# Altium project c1-12.PrjPCB (part 3 of 3)
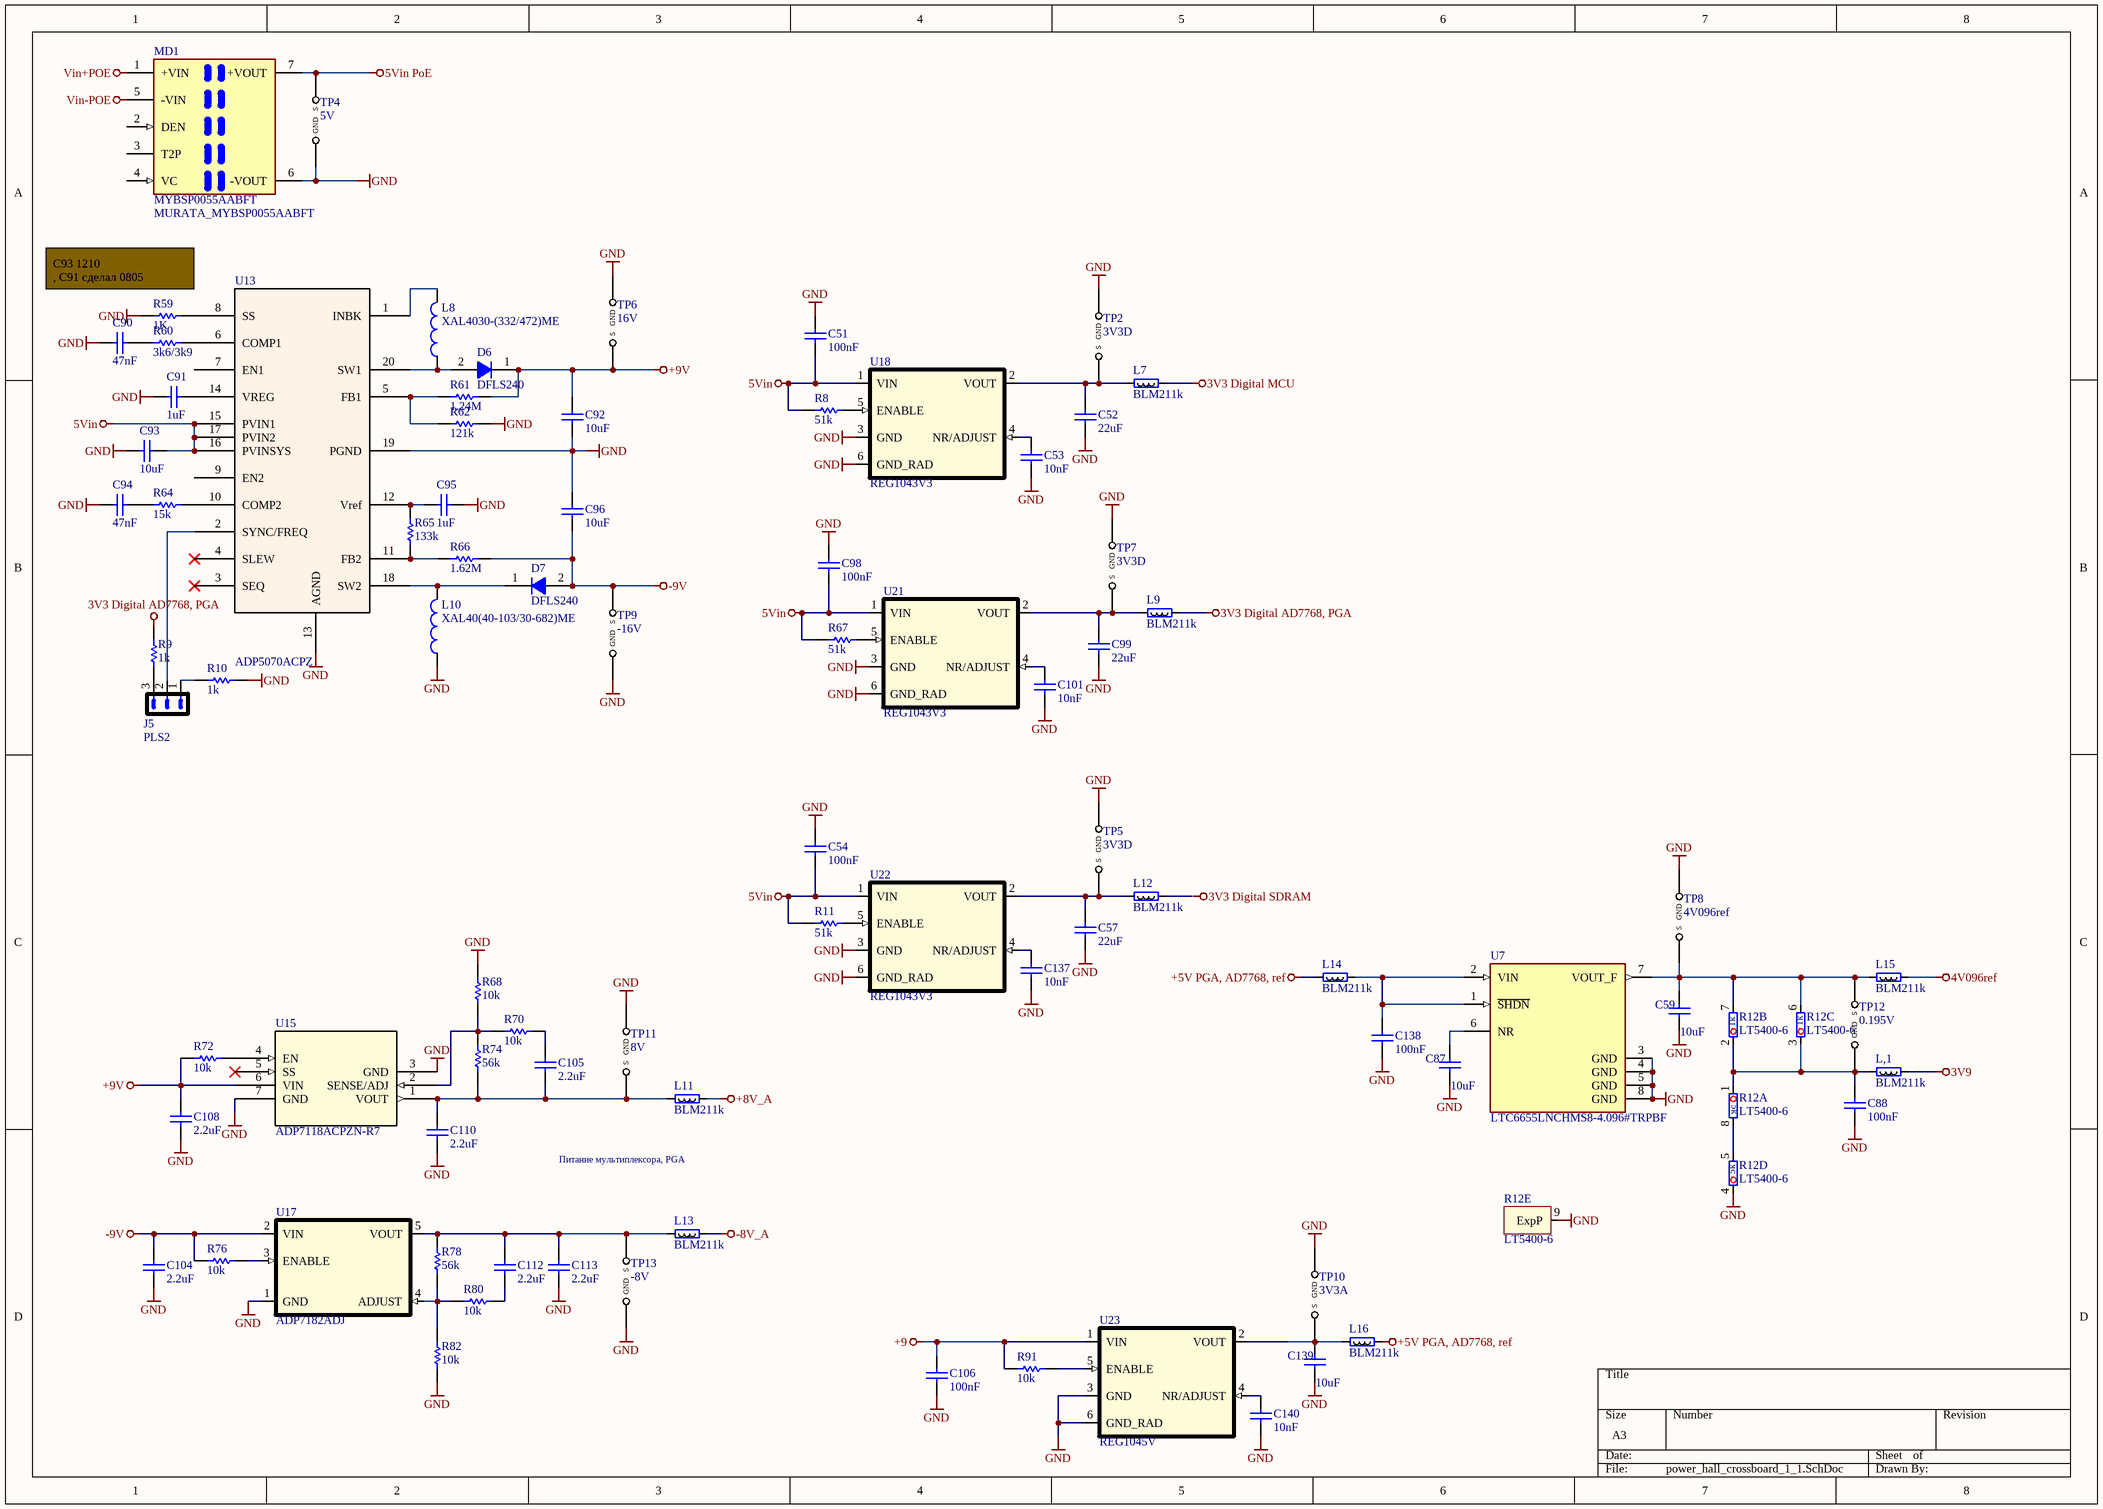
[diagram p10: power_hall_crossboard_1_1.SchDoc]

## Nets that join several sheets
2V5 VOCM AD7768: AD7768_inputs_hall_crossboard_1_1 (U1.59), U_AD7768_inputs_hall_crossboard_1_1/meas_ch1 (meas_ch1_C48.2 meas_ch1_U6.21), U_AD7768_inputs_hall_crossboard_1_1/meas_ch2 (meas_ch2_C48.2 meas_ch2_U6.21), U_AD7768_inputs_hall_crossboard_1_1/meas_ch3 (meas_ch3_C48.2 meas_ch3_U6.21), U_AD7768_inputs_hall_crossboard_1_1/meas_ch4 (meas_ch4_C48.2 meas_ch4_U6.21), U_AD7768_inputs_hall_crossboard_1_1/meas_ch5 (meas_ch5_C48.2 meas_ch5_U6.21), U_AD7768_inputs_hall_crossboard_1_1/meas_ch6 (meas_ch6_C48.2 meas_ch6_U6.21), U_AD7768_inputs_hall_crossboard_1_1/meas_ch7 (meas_ch7_C48.2 meas_ch7_U6.21), U_AD7768_inputs_hall_crossboard_1_1/meas_ch8 (meas_ch8_C48.2 meas_ch8_U6.21)
3V3 Digital AD7768, PGA: MCU_hall_crossboard_1_1 (C103.1 R94.1 R101.2 Y2.4), POE_UART_hall_crossboard_1_1 (L6.2), AD7768_hall_crossboard_1_1 (12 pins), st-link_v2_hall_crossboard_1_1 (L18.2 L19.2), U_AD7768_inputs_hall_crossboard_1_1/meas_ch1 (meas_ch1_C46.1 meas_ch1_R85.2 meas_ch1_U6.7), U_AD7768_inputs_hall_crossboard_1_1/meas_ch2 (meas_ch2_C46.1 meas_ch2_R85.2 meas_ch2_U6.7), U_AD7768_inputs_hall_crossboard_1_1/meas_ch3 (meas_ch3_C46.1 meas_ch3_R85.2 meas_ch3_U6.7), U_AD7768_inputs_hall_crossboard_1_1/meas_ch4 (meas_ch4_C46.1 meas_ch4_R85.2 meas_ch4_U6.7), U_AD7768_inputs_hall_crossboard_1_1/meas_ch5 (meas_ch5_C46.1 meas_ch5_R85.2 meas_ch5_U6.7), U_AD7768_inputs_hall_crossboard_1_1/meas_ch6 (meas_ch6_C46.1 meas_ch6_R85.2 meas_ch6_U6.7), U_AD7768_inputs_hall_crossboard_1_1/meas_ch7 (meas_ch7_C46.1 meas_ch7_R85.2 meas_ch7_U6.7), U_AD7768_inputs_hall_crossboard_1_1/meas_ch8 (meas_ch8_C46.1 meas_ch8_R85.2 meas_ch8_U6.7), power_hall_crossboard_1_1 (L9.2 R9.1)
3V3 Digital MCU: main_hall_crossboard_1_1 (C22.2 R6.2 U3.14), MCU_hall_crossboard_1_1 (25 pins), power_hall_crossboard_1_1 (L7.2)
3V3 Digital SDRAM: MCU_hall_crossboard_1_1 (R98.2), SDRAM_hall_crossboard_1_1 (L17.1)
3V3 USB protection: POE_UART_hall_crossboard_1_1 (CR1.5), st-link_v2_hall_crossboard_1_1 (CR2.5 L19.1 T4.3)
3V9: U_AD7768_inputs_hall_crossboard_1_1/meas_ch1 (meas_ch1_U6.4), U_AD7768_inputs_hall_crossboard_1_1/meas_ch2 (meas_ch2_U6.4), U_AD7768_inputs_hall_crossboard_1_1/meas_ch3 (meas_ch3_U6.4), U_AD7768_inputs_hall_crossboard_1_1/meas_ch4 (meas_ch4_U6.4), U_AD7768_inputs_hall_crossboard_1_1/meas_ch5 (meas_ch5_U6.4), U_AD7768_inputs_hall_crossboard_1_1/meas_ch6 (meas_ch6_U6.4), U_AD7768_inputs_hall_crossboard_1_1/meas_ch7 (meas_ch7_U6.4), U_AD7768_inputs_hall_crossboard_1_1/meas_ch8 (meas_ch8_U6.4), power_hall_crossboard_1_1 (L,1.2)
4V096ref: AD7768_hall_crossboard_1_1 (6 pins), U_AD7768_inputs_hall_crossboard_1_1/meas_ch1 (meas_ch1_U6.3), U_AD7768_inputs_hall_crossboard_1_1/meas_ch2 (meas_ch2_U6.3), U_AD7768_inputs_hall_crossboard_1_1/meas_ch3 (meas_ch3_U6.3), U_AD7768_inputs_hall_crossboard_1_1/meas_ch4 (meas_ch4_U6.3), U_AD7768_inputs_hall_crossboard_1_1/meas_ch5 (meas_ch5_U6.3), U_AD7768_inputs_hall_crossboard_1_1/meas_ch6 (meas_ch6_U6.3), U_AD7768_inputs_hall_crossboard_1_1/meas_ch7 (meas_ch7_U6.3), U_AD7768_inputs_hall_crossboard_1_1/meas_ch8 (meas_ch8_U6.3), power_hall_crossboard_1_1 (L15.2)
5Vin: main_hall_crossboard_1_1 (L1.2), MCU_hall_crossboard_1_1 (12 pins), POE_UART_hall_crossboard_1_1 (C72.2 DD2.2 DD2.3 K.2), power_hall_crossboard_1_1 (13 pins)
5Vin PoE: POE_UART_hall_crossboard_1_1 (K.4), power_hall_crossboard_1_1 (MD1.7 TP4.1)
+5V PGA, AD7768, ref: MCU_hall_crossboard_1_1 (R95.2), AD7768_hall_crossboard_1_1 (12 pins), U_AD7768_inputs_hall_crossboard_1_1/meas_ch1 (meas_ch1_L3.1), U_AD7768_inputs_hall_crossboard_1_1/meas_ch2 (meas_ch2_L3.1), U_AD7768_inputs_hall_crossboard_1_1/meas_ch3 (meas_ch3_L3.1), U_AD7768_inputs_hall_crossboard_1_1/meas_ch4 (meas_ch4_L3.1), U_AD7768_inputs_hall_crossboard_1_1/meas_ch5 (meas_ch5_L3.1), U_AD7768_inputs_hall_crossboard_1_1/meas_ch6 (meas_ch6_L3.1), U_AD7768_inputs_hall_crossboard_1_1/meas_ch7 (meas_ch7_L3.1), U_AD7768_inputs_hall_crossboard_1_1/meas_ch8 (meas_ch8_L3.1), power_hall_crossboard_1_1 (L14.1 L16.2)
+8V_A: U_AD7768_inputs_hall_crossboard_1_1/meas_ch1 (meas_ch1_C49.2 meas_ch1_C56.1 meas_ch1_U6.26 meas_ch1_U9.12), U_AD7768_inputs_hall_crossboard_1_1/meas_ch2 (meas_ch2_C49.2 meas_ch2_C56.1 meas_ch2_U6.26 meas_ch2_U9.12), U_AD7768_inputs_hall_crossboard_1_1/meas_ch3 (meas_ch3_C49.2 meas_ch3_C56.1 meas_ch3_U6.26 meas_ch3_U9.12), U_AD7768_inputs_hall_crossboard_1_1/meas_ch4 (meas_ch4_C49.2 meas_ch4_C56.1 meas_ch4_U6.26 meas_ch4_U9.12), U_AD7768_inputs_hall_crossboard_1_1/meas_ch5 (meas_ch5_C49.2 meas_ch5_C56.1 meas_ch5_U6.26 meas_ch5_U9.12), U_AD7768_inputs_hall_crossboard_1_1/meas_ch6 (meas_ch6_C49.2 meas_ch6_C56.1 meas_ch6_U6.26 meas_ch6_U9.12), U_AD7768_inputs_hall_crossboard_1_1/meas_ch7 (meas_ch7_C49.2 meas_ch7_C56.1 meas_ch7_U6.26 meas_ch7_U9.12), U_AD7768_inputs_hall_crossboard_1_1/meas_ch8 (meas_ch8_C49.2 meas_ch8_C56.1 meas_ch8_U6.26 meas_ch8_U9.12), power_hall_crossboard_1_1 (L11.2)
-8V_A: U_AD7768_inputs_hall_crossboard_1_1/meas_ch1 (meas_ch1_C50.2 meas_ch1_C114.2 meas_ch1_U6.27 meas_ch1_U9.1), U_AD7768_inputs_hall_crossboard_1_1/meas_ch1/U_source_of_current_hall_crossboard_1_1 (6 pins), U_AD7768_inputs_hall_crossboard_1_1/meas_ch2 (meas_ch2_C50.2 meas_ch2_C114.2 meas_ch2_U6.27 meas_ch2_U9.1), U_AD7768_inputs_hall_crossboard_1_1/meas_ch2/U_source_of_current_hall_crossboard_1_1 (6 pins), U_AD7768_inputs_hall_crossboard_1_1/meas_ch3 (meas_ch3_C50.2 meas_ch3_C114.2 meas_ch3_U6.27 meas_ch3_U9.1), U_AD7768_inputs_hall_crossboard_1_1/meas_ch3/U_source_of_current_hall_crossboard_1_1 (6 pins), U_AD7768_inputs_hall_crossboard_1_1/meas_ch4 (meas_ch4_C50.2 meas_ch4_C114.2 meas_ch4_U6.27 meas_ch4_U9.1), U_AD7768_inputs_hall_crossboard_1_1/meas_ch4/U_source_of_current_hall_crossboard_1_1 (6 pins), U_AD7768_inputs_hall_crossboard_1_1/meas_ch5 (meas_ch5_C50.2 meas_ch5_C114.2 meas_ch5_U6.27 meas_ch5_U9.1), U_AD7768_inputs_hall_crossboard_1_1/meas_ch5/U_source_of_current_hall_crossboard_1_1 (6 pins), U_AD7768_inputs_hall_crossboard_1_1/meas_ch6 (meas_ch6_C50.2 meas_ch6_C114.2 meas_ch6_U6.27 meas_ch6_U9.1), U_AD7768_inputs_hall_crossboard_1_1/meas_ch6/U_source_of_current_hall_crossboard_1_1 (6 pins), U_AD7768_inputs_hall_crossboard_1_1/meas_ch7 (meas_ch7_C50.2 meas_ch7_C114.2 meas_ch7_U6.27 meas_ch7_U9.1), U_AD7768_inputs_hall_crossboard_1_1/meas_ch7/U_source_of_current_hall_crossboard_1_1 (6 pins), U_AD7768_inputs_hall_crossboard_1_1/meas_ch8 (meas_ch8_C50.2 meas_ch8_C114.2 meas_ch8_U6.27 meas_ch8_U9.1), U_AD7768_inputs_hall_crossboard_1_1/meas_ch8/U_source_of_current_hall_crossboard_1_1 (6 pins), power_hall_crossboard_1_1 (L13.2)
Pt_100+: main_hall_crossboard_1_1 (8 pins), MCU_hall_crossboard_1_1 (62 pins), POE_UART_hall_crossboard_1_1 (43 pins), AD7768_hall_crossboard_1_1 (34 pins), st-link_v2_hall_crossboard_1_1 (7 pins), SDRAM_hall_crossboard_1_1 (24 pins), U_AD7768_inputs_hall_crossboard_1_1/meas_ch1 (18 pins), U_AD7768_inputs_hall_crossboard_1_1/meas_ch1/U_source_of_current_hall_crossboard_1_1 (8 pins), U_AD7768_inputs_hall_crossboard_1_1/meas_ch2 (18 pins), U_AD7768_inputs_hall_crossboard_1_1/meas_ch2/U_source_of_current_hall_crossboard_1_1 (8 pins), U_AD7768_inputs_hall_crossboard_1_1/meas_ch3 (18 pins), U_AD7768_inputs_hall_crossboard_1_1/meas_ch3/U_source_of_current_hall_crossboard_1_1 (8 pins), U_AD7768_inputs_hall_crossboard_1_1/meas_ch4 (18 pins), U_AD7768_inputs_hall_crossboard_1_1/meas_ch4/U_source_of_current_hall_crossboard_1_1 (8 pins), U_AD7768_inputs_hall_crossboard_1_1/meas_ch5 (18 pins), U_AD7768_inputs_hall_crossboard_1_1/meas_ch5/U_source_of_current_hall_crossboard_1_1 (8 pins), U_AD7768_inputs_hall_crossboard_1_1/meas_ch6 (18 pins), U_AD7768_inputs_hall_crossboard_1_1/meas_ch6/U_source_of_current_hall_crossboard_1_1 (8 pins), U_AD7768_inputs_hall_crossboard_1_1/meas_ch7 (18 pins), U_AD7768_inputs_hall_crossboard_1_1/meas_ch7/U_source_of_current_hall_crossboard_1_1 (8 pins), U_AD7768_inputs_hall_crossboard_1_1/meas_ch8 (18 pins), U_AD7768_inputs_hall_crossboard_1_1/meas_ch8/U_source_of_current_hall_crossboard_1_1 (8 pins), power_hall_crossboard_1_1 (63 pins)
Vin+POE: POE_UART_hall_crossboard_1_1 (D4.1 D5.1), power_hall_crossboard_1_1 (MD1.1)
Vin-POE: POE_UART_hall_crossboard_1_1 (D4.2 D5.2), power_hall_crossboard_1_1 (MD1.5)
-CHall_meas_ch1: U_AD7768_inputs_hall_crossboard_1_1/meas_ch1 (meas_ch1_J22.2 meas_ch1_U9.4), U_AD7768_inputs_hall_crossboard_1_1/meas_ch1/U_source_of_current_hall_crossboard_1_1 (U_AD7768_inputs_hall_crossboard_1_1_meas_ch1_U_source_of_current_hall_crossboard_1_1_R13.2 U_AD7768_inputs_hall_crossboard_1_1_meas_ch1_U_source_of_current_hall_crossboard_1_1_TP14.2)
-CHall_meas_ch2: U_AD7768_inputs_hall_crossboard_1_1/meas_ch2 (meas_ch2_J22.2 meas_ch2_U9.4), U_AD7768_inputs_hall_crossboard_1_1/meas_ch2/U_source_of_current_hall_crossboard_1_1 (U_AD7768_inputs_hall_crossboard_1_1_meas_ch2_U_source_of_current_hall_crossboard_1_1_R13.2 U_AD7768_inputs_hall_crossboard_1_1_meas_ch2_U_source_of_current_hall_crossboard_1_1_TP14.2)
-CHall_meas_ch3: U_AD7768_inputs_hall_crossboard_1_1/meas_ch3 (meas_ch3_J22.2 meas_ch3_U9.4), U_AD7768_inputs_hall_crossboard_1_1/meas_ch3/U_source_of_current_hall_crossboard_1_1 (U_AD7768_inputs_hall_crossboard_1_1_meas_ch3_U_source_of_current_hall_crossboard_1_1_R13.2 U_AD7768_inputs_hall_crossboard_1_1_meas_ch3_U_source_of_current_hall_crossboard_1_1_TP14.2)
-CHall_meas_ch4: U_AD7768_inputs_hall_crossboard_1_1/meas_ch4 (meas_ch4_J22.2 meas_ch4_U9.4), U_AD7768_inputs_hall_crossboard_1_1/meas_ch4/U_source_of_current_hall_crossboard_1_1 (U_AD7768_inputs_hall_crossboard_1_1_meas_ch4_U_source_of_current_hall_crossboard_1_1_R13.2 U_AD7768_inputs_hall_crossboard_1_1_meas_ch4_U_source_of_current_hall_crossboard_1_1_TP14.2)
-CHall_meas_ch5: U_AD7768_inputs_hall_crossboard_1_1/meas_ch5 (meas_ch5_J22.2 meas_ch5_U9.4), U_AD7768_inputs_hall_crossboard_1_1/meas_ch5/U_source_of_current_hall_crossboard_1_1 (U_AD7768_inputs_hall_crossboard_1_1_meas_ch5_U_source_of_current_hall_crossboard_1_1_R13.2 U_AD7768_inputs_hall_crossboard_1_1_meas_ch5_U_source_of_current_hall_crossboard_1_1_TP14.2)
-CHall_meas_ch6: U_AD7768_inputs_hall_crossboard_1_1/meas_ch6 (meas_ch6_J22.2 meas_ch6_U9.4), U_AD7768_inputs_hall_crossboard_1_1/meas_ch6/U_source_of_current_hall_crossboard_1_1 (U_AD7768_inputs_hall_crossboard_1_1_meas_ch6_U_source_of_current_hall_crossboard_1_1_R13.2 U_AD7768_inputs_hall_crossboard_1_1_meas_ch6_U_source_of_current_hall_crossboard_1_1_TP14.2)
-CHall_meas_ch7: U_AD7768_inputs_hall_crossboard_1_1/meas_ch7 (meas_ch7_J22.2 meas_ch7_U9.4), U_AD7768_inputs_hall_crossboard_1_1/meas_ch7/U_source_of_current_hall_crossboard_1_1 (U_AD7768_inputs_hall_crossboard_1_1_meas_ch7_U_source_of_current_hall_crossboard_1_1_R13.2 U_AD7768_inputs_hall_crossboard_1_1_meas_ch7_U_source_of_current_hall_crossboard_1_1_TP14.2)
-CHall_meas_ch8: U_AD7768_inputs_hall_crossboard_1_1/meas_ch8 (meas_ch8_J22.2 meas_ch8_U9.4), U_AD7768_inputs_hall_crossboard_1_1/meas_ch8/U_source_of_current_hall_crossboard_1_1 (U_AD7768_inputs_hall_crossboard_1_1_meas_ch8_U_source_of_current_hall_crossboard_1_1_R13.2 U_AD7768_inputs_hall_crossboard_1_1_meas_ch8_U_source_of_current_hall_crossboard_1_1_TP14.2)
AD7768_DCLK: MCU_hall_crossboard_1_1 (U2.121), AD7768_hall_crossboard_1_1 (R31.2)
AD7768_DR: MCU_hall_crossboard_1_1 (U2.120), AD7768_hall_crossboard_1_1 (R19.2)
AD7768_RESET: MCU_hall_crossboard_1_1 (U2.122), AD7768_hall_crossboard_1_1 (R27.2)
AD7768_START: MCU_hall_crossboard_1_1 (U2.123), AD7768_hall_crossboard_1_1 (R4.2)
ADA4254_CS: MCU_hall_crossboard_1_1 (U2.38), U_AD7768_inputs_hall_crossboard_1_1/meas_ch1 (meas_ch1_R83.1), U_AD7768_inputs_hall_crossboard_1_1/meas_ch2 (meas_ch2_R83.1), U_AD7768_inputs_hall_crossboard_1_1/meas_ch3 (meas_ch3_R83.1), U_AD7768_inputs_hall_crossboard_1_1/meas_ch4 (meas_ch4_R83.1), U_AD7768_inputs_hall_crossboard_1_1/meas_ch5 (meas_ch5_R83.1), U_AD7768_inputs_hall_crossboard_1_1/meas_ch6 (meas_ch6_R83.1), U_AD7768_inputs_hall_crossboard_1_1/meas_ch7 (meas_ch7_R83.1), U_AD7768_inputs_hall_crossboard_1_1/meas_ch8 (meas_ch8_R83.1)
ADA4254_PGIO0: U_AD7768_inputs_hall_crossboard_1_1/meas_ch1 (meas_ch1_U6.18), U_AD7768_inputs_hall_crossboard_1_1/meas_ch2 (meas_ch2_U6.18), U_AD7768_inputs_hall_crossboard_1_1/meas_ch3 (meas_ch3_U6.18), U_AD7768_inputs_hall_crossboard_1_1/meas_ch4 (meas_ch4_U6.18), U_AD7768_inputs_hall_crossboard_1_1/meas_ch5 (meas_ch5_U6.18), U_AD7768_inputs_hall_crossboard_1_1/meas_ch6 (meas_ch6_U6.18), U_AD7768_inputs_hall_crossboard_1_1/meas_ch7 (meas_ch7_U6.18), U_AD7768_inputs_hall_crossboard_1_1/meas_ch8 (meas_ch8_U6.18)
ADA4254_PGIO1: U_AD7768_inputs_hall_crossboard_1_1/meas_ch1 (meas_ch1_U6.17), U_AD7768_inputs_hall_crossboard_1_1/meas_ch2 (meas_ch2_U6.17), U_AD7768_inputs_hall_crossboard_1_1/meas_ch3 (meas_ch3_U6.17), U_AD7768_inputs_hall_crossboard_1_1/meas_ch4 (meas_ch4_U6.17), U_AD7768_inputs_hall_crossboard_1_1/meas_ch5 (meas_ch5_U6.17), U_AD7768_inputs_hall_crossboard_1_1/meas_ch6 (meas_ch6_U6.17), U_AD7768_inputs_hall_crossboard_1_1/meas_ch7 (meas_ch7_U6.17), U_AD7768_inputs_hall_crossboard_1_1/meas_ch8 (meas_ch8_U6.17)
ADA4254_PGIO2: U_AD7768_inputs_hall_crossboard_1_1/meas_ch1 (meas_ch1_U6.16), U_AD7768_inputs_hall_crossboard_1_1/meas_ch2 (meas_ch2_U6.16), U_AD7768_inputs_hall_crossboard_1_1/meas_ch3 (meas_ch3_U6.16), U_AD7768_inputs_hall_crossboard_1_1/meas_ch4 (meas_ch4_U6.16), U_AD7768_inputs_hall_crossboard_1_1/meas_ch5 (meas_ch5_U6.16), U_AD7768_inputs_hall_crossboard_1_1/meas_ch6 (meas_ch6_U6.16), U_AD7768_inputs_hall_crossboard_1_1/meas_ch7 (meas_ch7_U6.16), U_AD7768_inputs_hall_crossboard_1_1/meas_ch8 (meas_ch8_U6.16)
ADA4254_PGIO3: U_AD7768_inputs_hall_crossboard_1_1/meas_ch1 (meas_ch1_U6.15), U_AD7768_inputs_hall_crossboard_1_1/meas_ch2 (meas_ch2_U6.15), U_AD7768_inputs_hall_crossboard_1_1/meas_ch3 (meas_ch3_U6.15), U_AD7768_inputs_hall_crossboard_1_1/meas_ch4 (meas_ch4_U6.15), U_AD7768_inputs_hall_crossboard_1_1/meas_ch5 (meas_ch5_U6.15), U_AD7768_inputs_hall_crossboard_1_1/meas_ch6 (meas_ch6_U6.15), U_AD7768_inputs_hall_crossboard_1_1/meas_ch7 (meas_ch7_U6.15), U_AD7768_inputs_hall_crossboard_1_1/meas_ch8 (meas_ch8_U6.15)
ADA4254_PGIO4: U_AD7768_inputs_hall_crossboard_1_1/meas_ch1 (meas_ch1_U6.14), U_AD7768_inputs_hall_crossboard_1_1/meas_ch2 (meas_ch2_U6.14), U_AD7768_inputs_hall_crossboard_1_1/meas_ch3 (meas_ch3_U6.14), U_AD7768_inputs_hall_crossboard_1_1/meas_ch4 (meas_ch4_U6.14), U_AD7768_inputs_hall_crossboard_1_1/meas_ch5 (meas_ch5_U6.14), U_AD7768_inputs_hall_crossboard_1_1/meas_ch6 (meas_ch6_U6.14), U_AD7768_inputs_hall_crossboard_1_1/meas_ch7 (meas_ch7_U6.14), U_AD7768_inputs_hall_crossboard_1_1/meas_ch8 (meas_ch8_U6.14)
ADG1609_A0: U_AD7768_inputs_hall_crossboard_1_1/meas_ch1 (meas_ch1_U9.15), U_AD7768_inputs_hall_crossboard_1_1/meas_ch2 (meas_ch2_U9.15), U_AD7768_inputs_hall_crossboard_1_1/meas_ch3 (meas_ch3_U9.15), U_AD7768_inputs_hall_crossboard_1_1/meas_ch4 (meas_ch4_U9.15), U_AD7768_inputs_hall_crossboard_1_1/meas_ch5 (meas_ch5_U9.15), U_AD7768_inputs_hall_crossboard_1_1/meas_ch6 (meas_ch6_U9.15), U_AD7768_inputs_hall_crossboard_1_1/meas_ch7 (meas_ch7_U9.15), U_AD7768_inputs_hall_crossboard_1_1/meas_ch8 (meas_ch8_U9.15)
ADG1609_A1: U_AD7768_inputs_hall_crossboard_1_1/meas_ch1 (meas_ch1_U9.14), U_AD7768_inputs_hall_crossboard_1_1/meas_ch2 (meas_ch2_U9.14), U_AD7768_inputs_hall_crossboard_1_1/meas_ch3 (meas_ch3_U9.14), U_AD7768_inputs_hall_crossboard_1_1/meas_ch4 (meas_ch4_U9.14), U_AD7768_inputs_hall_crossboard_1_1/meas_ch5 (meas_ch5_U9.14), U_AD7768_inputs_hall_crossboard_1_1/meas_ch6 (meas_ch6_U9.14), U_AD7768_inputs_hall_crossboard_1_1/meas_ch7 (meas_ch7_U9.14), U_AD7768_inputs_hall_crossboard_1_1/meas_ch8 (meas_ch8_U9.14)
MISO: MCU_hall_crossboard_1_1 (U2.193), AD7768_hall_crossboard_1_1 (R3.2), U_AD7768_inputs_hall_crossboard_1_1/meas_ch1 (meas_ch1_R77.1), U_AD7768_inputs_hall_crossboard_1_1/meas_ch2 (meas_ch2_R77.1), U_AD7768_inputs_hall_crossboard_1_1/meas_ch3 (meas_ch3_R77.1), U_AD7768_inputs_hall_crossboard_1_1/meas_ch4 (meas_ch4_R77.1), U_AD7768_inputs_hall_crossboard_1_1/meas_ch5 (meas_ch5_R77.1), U_AD7768_inputs_hall_crossboard_1_1/meas_ch6 (meas_ch6_R77.1), U_AD7768_inputs_hall_crossboard_1_1/meas_ch7 (meas_ch7_R77.1), U_AD7768_inputs_hall_crossboard_1_1/meas_ch8 (meas_ch8_R77.1)
MOSI: MCU_hall_crossboard_1_1 (U2.194), AD7768_hall_crossboard_1_1 (R21.2), U_AD7768_inputs_hall_crossboard_1_1/meas_ch1 (meas_ch1_R79.1), U_AD7768_inputs_hall_crossboard_1_1/meas_ch2 (meas_ch2_R79.1), U_AD7768_inputs_hall_crossboard_1_1/meas_ch3 (meas_ch3_R79.1), U_AD7768_inputs_hall_crossboard_1_1/meas_ch4 (meas_ch4_R79.1), U_AD7768_inputs_hall_crossboard_1_1/meas_ch5 (meas_ch5_R79.1), U_AD7768_inputs_hall_crossboard_1_1/meas_ch6 (meas_ch6_R79.1), U_AD7768_inputs_hall_crossboard_1_1/meas_ch7 (meas_ch7_R79.1), U_AD7768_inputs_hall_crossboard_1_1/meas_ch8 (meas_ch8_R79.1)
NetCN1_2: MCU_hall_crossboard_1_1 (U2.147), st-link_v2_hall_crossboard_1_1 (CN1.2)
NetCN1_3: MCU_hall_crossboard_1_1 (U2.159), st-link_v2_hall_crossboard_1_1 (CN1.3)
NetCR2_1: MCU_hall_crossboard_1_1 (U2.145), st-link_v2_hall_crossboard_1_1 (CR2.1)
NetCR2_3: MCU_hall_crossboard_1_1 (U2.146), st-link_v2_hall_crossboard_1_1 (CR2.3)
NetDD1_7: MCU_hall_crossboard_1_1 (U2.196), POE_UART_hall_crossboard_1_1 (DD1.7)
NetDD1_10: MCU_hall_crossboard_1_1 (U2.195), POE_UART_hall_crossboard_1_1 (DD1.10)
NetDD2_8: MCU_hall_crossboard_1_1 (U2.91), POE_UART_hall_crossboard_1_1 (DD2.8)
NetDD2_9: MCU_hall_crossboard_1_1 (U2.90), POE_UART_hall_crossboard_1_1 (DD2.9)
Netmeas_ch1_U6_12: U_AD7768_inputs_hall_crossboard_1_1/meas_ch1 (meas_ch1_U6.12), U_AD7768_inputs_hall_crossboard_1_1/meas_ch2 (meas_ch2_U6.12), U_AD7768_inputs_hall_crossboard_1_1/meas_ch3 (meas_ch3_U6.12), U_AD7768_inputs_hall_crossboard_1_1/meas_ch4 (meas_ch4_U6.12), U_AD7768_inputs_hall_crossboard_1_1/meas_ch5 (meas_ch5_U6.12), U_AD7768_inputs_hall_crossboard_1_1/meas_ch6 (meas_ch6_U6.12), U_AD7768_inputs_hall_crossboard_1_1/meas_ch7 (meas_ch7_U6.12), U_AD7768_inputs_hall_crossboard_1_1/meas_ch8 (meas_ch8_U6.12)
Netmeas_ch1_U6_13: U_AD7768_inputs_hall_crossboard_1_1/meas_ch1 (meas_ch1_U6.13), U_AD7768_inputs_hall_crossboard_1_1/meas_ch2 (meas_ch2_U6.13), U_AD7768_inputs_hall_crossboard_1_1/meas_ch3 (meas_ch3_U6.13), U_AD7768_inputs_hall_crossboard_1_1/meas_ch4 (meas_ch4_U6.13), U_AD7768_inputs_hall_crossboard_1_1/meas_ch5 (meas_ch5_U6.13), U_AD7768_inputs_hall_crossboard_1_1/meas_ch6 (meas_ch6_U6.13), U_AD7768_inputs_hall_crossboard_1_1/meas_ch7 (meas_ch7_U6.13), U_AD7768_inputs_hall_crossboard_1_1/meas_ch8 (meas_ch8_U6.13)
Netmeas_ch1_U9_9: U_AD7768_inputs_hall_crossboard_1_1/meas_ch1 (meas_ch1_U9.9), U_AD7768_inputs_hall_crossboard_1_1/meas_ch1/U_source_of_current_hall_crossboard_1_1 (U_AD7768_inputs_hall_crossboard_1_1_meas_ch1_U_source_of_current_hall_crossboard_1_1_J10.2 U_AD7768_inputs_hall_crossboard_1_1_meas_ch1_U_source_of_current_hall_crossboard_1_1_R13.1 U_AD7768_inputs_hall_crossboard_1_1_meas_ch1_U_source_of_current_hall_crossboard_1_1_TP14.1 U_AD7768_inputs_hall_crossboard_1_1_meas_ch1_U_source_of_current_hall_crossboard_1_1_TP15.2)
Netmeas_ch2_U9_9: U_AD7768_inputs_hall_crossboard_1_1/meas_ch2 (meas_ch2_U9.9), U_AD7768_inputs_hall_crossboard_1_1/meas_ch2/U_source_of_current_hall_crossboard_1_1 (U_AD7768_inputs_hall_crossboard_1_1_meas_ch2_U_source_of_current_hall_crossboard_1_1_J10.2 U_AD7768_inputs_hall_crossboard_1_1_meas_ch2_U_source_of_current_hall_crossboard_1_1_R13.1 U_AD7768_inputs_hall_crossboard_1_1_meas_ch2_U_source_of_current_hall_crossboard_1_1_TP14.1 U_AD7768_inputs_hall_crossboard_1_1_meas_ch2_U_source_of_current_hall_crossboard_1_1_TP15.2)
Netmeas_ch3_U9_9: U_AD7768_inputs_hall_crossboard_1_1/meas_ch3 (meas_ch3_U9.9), U_AD7768_inputs_hall_crossboard_1_1/meas_ch3/U_source_of_current_hall_crossboard_1_1 (U_AD7768_inputs_hall_crossboard_1_1_meas_ch3_U_source_of_current_hall_crossboard_1_1_J10.2 U_AD7768_inputs_hall_crossboard_1_1_meas_ch3_U_source_of_current_hall_crossboard_1_1_R13.1 U_AD7768_inputs_hall_crossboard_1_1_meas_ch3_U_source_of_current_hall_crossboard_1_1_TP14.1 U_AD7768_inputs_hall_crossboard_1_1_meas_ch3_U_source_of_current_hall_crossboard_1_1_TP15.2)
Netmeas_ch4_U9_9: U_AD7768_inputs_hall_crossboard_1_1/meas_ch4 (meas_ch4_U9.9), U_AD7768_inputs_hall_crossboard_1_1/meas_ch4/U_source_of_current_hall_crossboard_1_1 (U_AD7768_inputs_hall_crossboard_1_1_meas_ch4_U_source_of_current_hall_crossboard_1_1_J10.2 U_AD7768_inputs_hall_crossboard_1_1_meas_ch4_U_source_of_current_hall_crossboard_1_1_R13.1 U_AD7768_inputs_hall_crossboard_1_1_meas_ch4_U_source_of_current_hall_crossboard_1_1_TP14.1 U_AD7768_inputs_hall_crossboard_1_1_meas_ch4_U_source_of_current_hall_crossboard_1_1_TP15.2)
Netmeas_ch5_U9_9: U_AD7768_inputs_hall_crossboard_1_1/meas_ch5 (meas_ch5_U9.9), U_AD7768_inputs_hall_crossboard_1_1/meas_ch5/U_source_of_current_hall_crossboard_1_1 (U_AD7768_inputs_hall_crossboard_1_1_meas_ch5_U_source_of_current_hall_crossboard_1_1_J10.2 U_AD7768_inputs_hall_crossboard_1_1_meas_ch5_U_source_of_current_hall_crossboard_1_1_R13.1 U_AD7768_inputs_hall_crossboard_1_1_meas_ch5_U_source_of_current_hall_crossboard_1_1_TP14.1 U_AD7768_inputs_hall_crossboard_1_1_meas_ch5_U_source_of_current_hall_crossboard_1_1_TP15.2)
Netmeas_ch6_U9_9: U_AD7768_inputs_hall_crossboard_1_1/meas_ch6 (meas_ch6_U9.9), U_AD7768_inputs_hall_crossboard_1_1/meas_ch6/U_source_of_current_hall_crossboard_1_1 (U_AD7768_inputs_hall_crossboard_1_1_meas_ch6_U_source_of_current_hall_crossboard_1_1_J10.2 U_AD7768_inputs_hall_crossboard_1_1_meas_ch6_U_source_of_current_hall_crossboard_1_1_R13.1 U_AD7768_inputs_hall_crossboard_1_1_meas_ch6_U_source_of_current_hall_crossboard_1_1_TP14.1 U_AD7768_inputs_hall_crossboard_1_1_meas_ch6_U_source_of_current_hall_crossboard_1_1_TP15.2)
Netmeas_ch7_U9_9: U_AD7768_inputs_hall_crossboard_1_1/meas_ch7 (meas_ch7_U9.9), U_AD7768_inputs_hall_crossboard_1_1/meas_ch7/U_source_of_current_hall_crossboard_1_1 (U_AD7768_inputs_hall_crossboard_1_1_meas_ch7_U_source_of_current_hall_crossboard_1_1_J10.2 U_AD7768_inputs_hall_crossboard_1_1_meas_ch7_U_source_of_current_hall_crossboard_1_1_R13.1 U_AD7768_inputs_hall_crossboard_1_1_meas_ch7_U_source_of_current_hall_crossboard_1_1_TP14.1 U_AD7768_inputs_hall_crossboard_1_1_meas_ch7_U_source_of_current_hall_crossboard_1_1_TP15.2)
Netmeas_ch8_U9_9: U_AD7768_inputs_hall_crossboard_1_1/meas_ch8 (meas_ch8_U9.9), U_AD7768_inputs_hall_crossboard_1_1/meas_ch8/U_source_of_current_hall_crossboard_1_1 (U_AD7768_inputs_hall_crossboard_1_1_meas_ch8_U_source_of_current_hall_crossboard_1_1_J10.2 U_AD7768_inputs_hall_crossboard_1_1_meas_ch8_U_source_of_current_hall_crossboard_1_1_R13.1 U_AD7768_inputs_hall_crossboard_1_1_meas_ch8_U_source_of_current_hall_crossboard_1_1_TP14.1 U_AD7768_inputs_hall_crossboard_1_1_meas_ch8_U_source_of_current_hall_crossboard_1_1_TP15.2)
NetR48_1: MCU_hall_crossboard_1_1 (U2.57), POE_UART_hall_crossboard_1_1 (R48.1)
NetR49_1: MCU_hall_crossboard_1_1 (U2.58), POE_UART_hall_crossboard_1_1 (R49.1)
NetR51_1: MCU_hall_crossboard_1_1 (U2.56), POE_UART_hall_crossboard_1_1 (R51.1)
NetR53_1: MCU_hall_crossboard_1_1 (U2.45), POE_UART_hall_crossboard_1_1 (R53.1 U11.12)
NetR55_1: MCU_hall_crossboard_1_1 (U2.44), POE_UART_hall_crossboard_1_1 (R55.1)
NetU2_35: MCU_hall_crossboard_1_1 (U2.35), SDRAM_hall_crossboard_1_1 (U19.17)
NetU2_36: MCU_hall_crossboard_1_1 (U2.36), POE_UART_hall_crossboard_1_1 (U11.13)
NetU2_46: MCU_hall_crossboard_1_1 (U2.46), SDRAM_hall_crossboard_1_1 (U19.67)
NetU2_70: MCU_hall_crossboard_1_1 (U2.70), SDRAM_hall_crossboard_1_1 (U19.19)
NetU2_135: MCU_hall_crossboard_1_1 (U2.135), SDRAM_hall_crossboard_1_1 (U19.68)
NetU2_144: MCU_hall_crossboard_1_1 (U2.144), st-link_v2_hall_crossboard_1_1 (X2.4)
NetU2_177: MCU_hall_crossboard_1_1 (U2.177), SDRAM_hall_crossboard_1_1 (U19.20)
NetU2_180: MCU_hall_crossboard_1_1 (U2.180), POE_UART_hall_crossboard_1_1 (U11.16)
NetU2_182: MCU_hall_crossboard_1_1 (U2.182), POE_UART_hall_crossboard_1_1 (U11.17)
NetU2_183: MCU_hall_crossboard_1_1 (U2.183), POE_UART_hall_crossboard_1_1 (U11.18)
NetU2_191: MCU_hall_crossboard_1_1 (U2.191), SDRAM_hall_crossboard_1_1 (U19.18)
NRST: MCU_hall_crossboard_1_1 (R92.1 U2.34 U8.1), POE_UART_hall_crossboard_1_1 (U11.15)
Radiation_signal: main_hall_crossboard_1_1 (U3.4), MCU_hall_crossboard_1_1 (U2.176), U_AD7768_inputs_hall_crossboard_1_1/meas_ch1/U_source_of_current_hall_crossboard_1_1 (U_AD7768_inputs_hall_crossboard_1_1_meas_ch1_U_source_of_current_hall_crossboard_1_1_U20.1), U_AD7768_inputs_hall_crossboard_1_1/meas_ch2/U_source_of_current_hall_crossboard_1_1 (U_AD7768_inputs_hall_crossboard_1_1_meas_ch2_U_source_of_current_hall_crossboard_1_1_U20.1), U_AD7768_inputs_hall_crossboard_1_1/meas_ch3/U_source_of_current_hall_crossboard_1_1 (U_AD7768_inputs_hall_crossboard_1_1_meas_ch3_U_source_of_current_hall_crossboard_1_1_U20.1), U_AD7768_inputs_hall_crossboard_1_1/meas_ch4/U_source_of_current_hall_crossboard_1_1 (U_AD7768_inputs_hall_crossboard_1_1_meas_ch4_U_source_of_current_hall_crossboard_1_1_U20.1), U_AD7768_inputs_hall_crossboard_1_1/meas_ch5/U_source_of_current_hall_crossboard_1_1 (U_AD7768_inputs_hall_crossboard_1_1_meas_ch5_U_source_of_current_hall_crossboard_1_1_U20.1), U_AD7768_inputs_hall_crossboard_1_1/meas_ch6/U_source_of_current_hall_crossboard_1_1 (U_AD7768_inputs_hall_crossboard_1_1_meas_ch6_U_source_of_current_hall_crossboard_1_1_U20.1), U_AD7768_inputs_hall_crossboard_1_1/meas_ch7/U_source_of_current_hall_crossboard_1_1 (U_AD7768_inputs_hall_crossboard_1_1_meas_ch7_U_source_of_current_hall_crossboard_1_1_U20.1), U_AD7768_inputs_hall_crossboard_1_1/meas_ch8/U_source_of_current_hall_crossboard_1_1 (U_AD7768_inputs_hall_crossboard_1_1_meas_ch8_U_source_of_current_hall_crossboard_1_1_U20.1)
SCLK: MCU_hall_crossboard_1_1 (U2.192), AD7768_hall_crossboard_1_1 (R23.2), U_AD7768_inputs_hall_crossboard_1_1/meas_ch1 (meas_ch1_R81.1), U_AD7768_inputs_hall_crossboard_1_1/meas_ch2 (meas_ch2_R81.1), U_AD7768_inputs_hall_crossboard_1_1/meas_ch3 (meas_ch3_R81.1), U_AD7768_inputs_hall_crossboard_1_1/meas_ch4 (meas_ch4_R81.1), U_AD7768_inputs_hall_crossboard_1_1/meas_ch5 (meas_ch5_R81.1), U_AD7768_inputs_hall_crossboard_1_1/meas_ch6 (meas_ch6_R81.1), U_AD7768_inputs_hall_crossboard_1_1/meas_ch7 (meas_ch7_R81.1), U_AD7768_inputs_hall_crossboard_1_1/meas_ch8 (meas_ch8_R81.1)
uC_off: main_hall_crossboard_1_1 (U3.5), MCU_hall_crossboard_1_1 (U2.175)
VinM_planar1: AD7768_inputs_hall_crossboard_1_1 (U1.63), U_AD7768_inputs_hall_crossboard_1_1/meas_ch1 (meas_ch1_U6.20)
VinM_planar2: AD7768_inputs_hall_crossboard_1_1 (U1.1), U_AD7768_inputs_hall_crossboard_1_1/meas_ch2 (meas_ch2_U6.20)
VinM_planar3: AD7768_inputs_hall_crossboard_1_1 (U1.7), U_AD7768_inputs_hall_crossboard_1_1/meas_ch3 (meas_ch3_U6.20)
VinM_planar4: AD7768_inputs_hall_crossboard_1_1 (U1.9), U_AD7768_inputs_hall_crossboard_1_1/meas_ch4 (meas_ch4_U6.20)
VinM_planar5: AD7768_inputs_hall_crossboard_1_1 (U1.50), U_AD7768_inputs_hall_crossboard_1_1/meas_ch5 (meas_ch5_U6.20)
VinM_planar6: AD7768_inputs_hall_crossboard_1_1 (U1.48), U_AD7768_inputs_hall_crossboard_1_1/meas_ch6 (meas_ch6_U6.20)
VinM_planar7: AD7768_inputs_hall_crossboard_1_1 (U1.42), U_AD7768_inputs_hall_crossboard_1_1/meas_ch7 (meas_ch7_U6.20)
VinM_planar8: AD7768_inputs_hall_crossboard_1_1 (U1.40), U_AD7768_inputs_hall_crossboard_1_1/meas_ch8 (meas_ch8_U6.20)
VinP_planar1: AD7768_inputs_hall_crossboard_1_1 (U1.64), U_AD7768_inputs_hall_crossboard_1_1/meas_ch1 (meas_ch1_U6.19)
VinP_planar2: AD7768_inputs_hall_crossboard_1_1 (U1.2), U_AD7768_inputs_hall_crossboard_1_1/meas_ch2 (meas_ch2_U6.19)
VinP_planar3: AD7768_inputs_hall_crossboard_1_1 (U1.8), U_AD7768_inputs_hall_crossboard_1_1/meas_ch3 (meas_ch3_U6.19)
VinP_planar4: AD7768_inputs_hall_crossboard_1_1 (U1.10), U_AD7768_inputs_hall_crossboard_1_1/meas_ch4 (meas_ch4_U6.19)
VinP_planar5: AD7768_inputs_hall_crossboard_1_1 (U1.49), U_AD7768_inputs_hall_crossboard_1_1/meas_ch5 (meas_ch5_U6.19)
VinP_planar6: AD7768_inputs_hall_crossboard_1_1 (U1.47), U_AD7768_inputs_hall_crossboard_1_1/meas_ch6 (meas_ch6_U6.19)
VinP_planar7: AD7768_inputs_hall_crossboard_1_1 (U1.41), U_AD7768_inputs_hall_crossboard_1_1/meas_ch7 (meas_ch7_U6.19)
VinP_planar8: AD7768_inputs_hall_crossboard_1_1 (U1.39), U_AD7768_inputs_hall_crossboard_1_1/meas_ch8 (meas_ch8_U6.19)